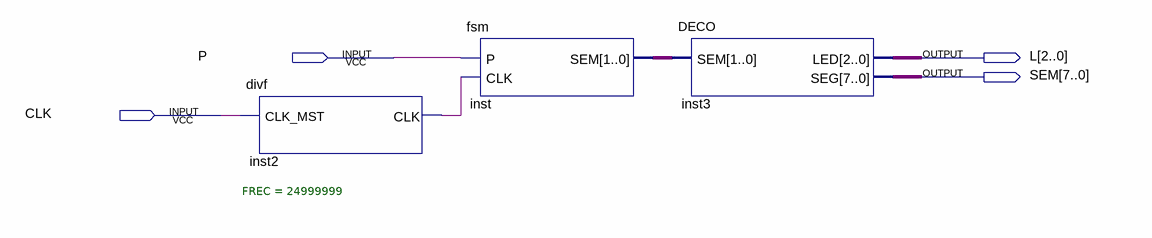
[diagram p0: schematic sheet]
// Quartus schematic practica06.bdf as structural Verilog: 3 symbols, 4 pins
module practica06 (
  input  P,
  input  CLK,
  output [2:0] L,
  output [7:0] SEM
);

  wire inst2_clk;
  wire [1:0] inst_sem;

  divf #(.FREC(24999999)) inst2 (.CLK_MST(CLK), .CLK(inst2_clk));
  fsm inst (.P(P), .CLK(inst2_clk), .SEM(inst_sem));
  DECO inst3 (.SEM(inst_sem), .LED(L), .SEG(SEM));
endmodule
